# Altium schematic sheet Wi-Fi.SchDoc
size A4; SheetNumber: 7; SheetTotal: 7
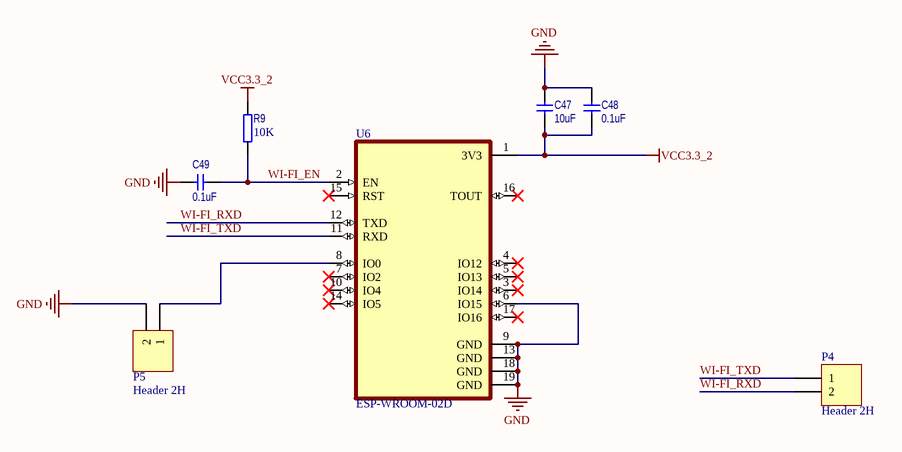
[diagram p0: Wi-Fi.SchDoc]

## Parts
C47  10uF  [C 0603_M]
C48  0.1uF  [C 0603_M]
C49  0.1uF  [C 0603_M]
P4  Header 2H  [HDR2.54-LI-2P]
P5  Header 2H  [HDR2.54-LI-2P]
R9  10K  [0603R]
U6  ESP-WROOM-02D  [ESP-WROOM-02D]

## Nets
GND: C47.2 C48.2 C49.2 P5.2 U6.6(IO15) U6.9(GND) U6.13(GND) U6.18(GND) U6.19(GND)
VCC3.3_2: C47.1 C48.1 R9.2 U6.1(3V3)
WI-FI_EN: C49.1 R9.1 U6.2(EN)
WI-FI_RXD: P4.2 U6.12(TXD)
WI-FI_TXD: P4.1 U6.11(RXD)
NetP5_1: P5.1 U6.8(IO0)

Not connected (* = marked no-connect by the designer): U6 3(IO14)* 4(IO12)* 5(IO13)* 7(IO2)* 10(IO4)* 14(IO5)* 15(RST)* 16(TOUT)* 17(IO16)*

## Library data of the parts
C47-C49 = ProE.tmp_22p_13
P4 P5 = Header 2H: Header, 2-Pin, Right Angle; LatestRevisionDate: 17-Jul-2002; LatestRevisionNote: Re-released for DXP Platform.; Publisher: Altium Limited
R9 = ProE.tmp_10k_66: Value: 10K
U6 = ESP-WROOM-02D: WiFi 802.11b/g/n Transceiver Module 2.4GHz ~ 2.5GHz Integrated, Trace Surface Mount; MF: Espressif Systems; Value: *; SnapEDA_Link: https://www.snapeda.com/parts/ESP-WROOM-02D/Espressif%20Systems/view-part/2779866/?ref=snap; Availability: Unavailable; Price: None; Package: SMD-18 Espressif Systems; MP: ESP-WROOM-02D